# Altium schematic sheet sd_accel.SchDoc
size A
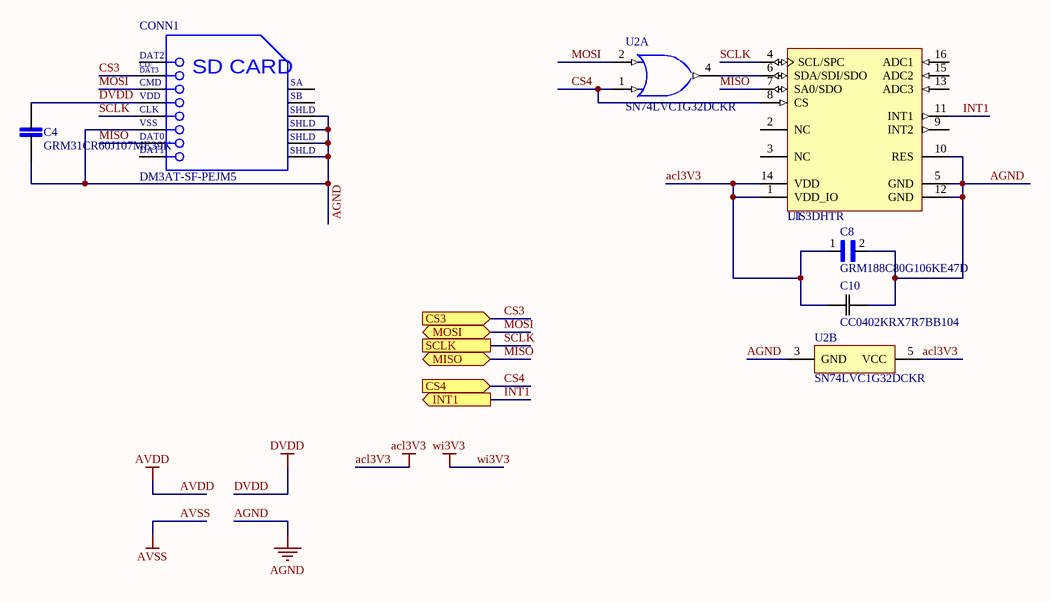
[diagram p0: sd_accel.SchDoc]

## Parts
C4  GRM31CR60J107ME39K  [*CAPC3216X190]
C8  GRM188C80G106KE47D  [*CAPC1608X90N]
C10  CC0402KRX7R7BB104  [YAG_CC0402]
CONN1  DM3AT-SF-PEJM5  [HRS-DM3AT-8_V]
U1  LIS3DHTR  [STM-LGA-16]
U2  SN74LVC1G32DCKR  [DCK0005A_N]  (parts A,B of 2)

## Ports
CS3 (in), CS4 (in), INT1 (out), MISO (bidir), MOSI (bidir), SCLK

## Nets
acl3V3: C8.1 C10.1 U1.1(VDD_IO) U1.14(VDD) U2.5(VCC)
AGND: C4.2 C8.2 C10.2 CONN1.6(VSS) CONN1.11(SHLD) CONN1.12(SHLD) CONN1.13(SHLD) CONN1.14(SHLD) U1.5(GND) U1.10(RES) U1.12(GND) U2.3(GND)
DVDD: C4.1 CONN1.4(VDD)
CS3: CONN1.2(CD/DAT3) ; port CS3
CS4: U1.8(CS) U2.1(A) ; port CS4
INT1: U1.11(INT1) ; port INT1
MISO: CONN1.7(DAT0) U1.7(SA0/SDO) ; port MISO
MOSI: CONN1.3(CMD) U2.2(B) ; port MOSI
SCLK: CONN1.5(CLK) U1.4(SCL/SPC) ; port SCLK
NetU1_6: U1.6(SDA/SDI/SDO) U2.4(Y)

Not connected (* = marked no-connect by the designer): CONN1 1(DAT2) 8(DAT1) 9(SA) 10(SB); U1 2(NC) 3(NC) 9(INT2) 13(ADC3) 15(ADC2) 16(ADC1)

## Notes on the sheet
- (in symbol DM3AT-SF-PEJM5) CD/; DAT3; SD CARD

## Library data of the parts
C4 = GRM31CR60J107ME39K: MURATA - GRM31CR60J107ME39K - COND, 100µF, 6.3V, 20%, X5R, 1206; Capacitance: 100uF; Supplier 1: Digi-Key; Manufacturer 1: Murata; Manufacturer Part Number 1: GRM31CR60J107ME39K; Stock 1: 407390; Pricing 1: 1=0.98000, 10=0.77400, 100=0.58060, 500=0.43870, 1000=0.38709, 2500=0.36128 (USD); RoHS: Yes; Mount: Surface Mount; Case/Package: 1206; Case Code (Imperial): 1206; Case Code (Metric): 3216; Min Operating Temperature: -55°C; Max Operating Temperature: 85°C; Tolerance: 20%; Packaging: Tape and Reel; Package Quantity: 1; Voltage Rating: 6.3V; Dielectric: X5R; Termination: SMD/SMT; Voltage: 6.3V; Voltage Rating (DC): 6.3V; Length: 3.2mm; Height: 1.6mm; Width: 0.063inch; Thickness: 0.071inch; Depth: 1.6mm; Radiation Hardening: No; REACH SVHC: No SVHC; Lead Free: Lead Free; ComponentLink1URL: https://datasheet.ciiva.com/13246/product-13246228.pdf?src-supplier=Mouser; ComponentLink1Description: https://datasheet.ciiva.com/13246/product-13246228.pdf?src-supplier=Mouser; ComponentLink2URL: https://datasheet.ciiva.com/18697/grm31cr60j107me39-01-18697367.pdf?src-supplier=Digi-Key; ComponentLink2Description: https://datasheet.ciiva.com/18697/grm31cr60j107me39-01-18697367.pdf?src-supplier=Digi-Key; ComponentLink3URL: https://datasheet.ciiva.com/18697/grm31cr60j107me39-01-18697368.pdf?src-supplier=Digi-Key; ComponentLink3Description: https://datasheet.ciiva.com/18697/grm31cr60j107me39-01-18697368.pdf?src-supplier=Digi-Key; ComponentLink4URL: https://datasheet.ciiva.com/18697/grm31cr60j107me39-01-18697369.pdf?src-supplier=Digi-Key; ComponentLink4Description: https://datasheet.ciiva.com/18697/grm31cr60j107me39-01-18697369.pdf?src-supplier=Digi-Key; Supplier Part Number 1: 490-7217-1-ND
C8 = GRM188C80G106KE47D: CAP CER 10UF 4V X6S 0603; Manufacturer 1: Murata; Tolerance: 10%; Supplier 1: Digi-Key; Manufacturer Part Number 1: GRM188C80G106KE47D; Stock 1: 203819; Pricing 1: 1=0.17000, 10=0.11800, 100=0.05990, 500=0.04098, 1000=0.03625 (USD); RoHS: Yes; Mount: Surface Mount; Case/Package: 0603; Weight: 0.000222oz; Case Code (Metric): 1608; Case Code (Imperial): 0603; Min Operating Temperature: -55°C; Max Operating Temperature: 105°C; Capacitance: 10uF; Packaging: Tape and Reel; Voltage Rating: 4V; Dielectric: X6S; Termination: SMD/SMT; Voltage Rating (DC): 4V; Package Quantity: 4000; Length: 0.063inch; Height: 0.8mm; Width: 0.031inch; Thickness: 0.035inch; ComponentLink1URL: http://www.mouser.com/ds/2/281/c02e-2905.pdf?src-supplier=Mouser; ComponentLink1Description: http://www.mouser.com/ds/2/281/c02e-2905.pdf?src-supplier=Mouser; ComponentLink2URL: http://search.murata.co.jp/Ceramy/image/img/A01X/G101/ENG/GRM188C80G106KE47-01.pdf?src-supplier=Digi-Key; ComponentLink2Description: http://search.murata.co.jp/Ceramy/image/img/A01X/G101/ENG/GRM188C80G106KE47-01.pdf?src-supplier=Digi-Key; Supplier Part Number 1: 490-10469-1-ND
C10 = CC0402KRX7R7BB104: CAP CER 0.1UF 16V X7R 0402; Manufacturer 1: Yageo; Capacitance: 100nF; Tolerance: 10%; Supplier 1: Digi-Key; Manufacturer Part Number 1: CC0402KRX7R7BB104; Stock 1: 30032352; Pricing 1: 1=0.10000, 10=0.03200, 100=0.01420, 500=0.01014, 1000=0.00797, 2500=0.00724, 5000=0.00667 (USD); RoHS: Yes; Mount: Surface Mount; Case/Package: 0402; Number of Pins: 2; Case Code (Metric): 1005; Case Code (Imperial): 0402; Min Operating Temperature: -55°C; Max Operating Temperature: 125°C; Voltage Rating: 16V; Voltage Rating (DC): 16V; Packaging: Tape and Reel; Package Quantity: 1; Dielectric: X7R; Termination: SMD/SMT; Composition: Ceramic; Voltage: 16V; Length: 1mm; Height: 0.5mm; Width: 0.02inch; Thickness: 0.022inch; Depth: 0.5mm; Radiation Hardening: No; REACH SVHC: No SVHC; Lead Free: Lead Free; Halogen Free: Halogen Free; ComponentLink1URL: https://datasheet.ciiva.com/11788/0900766b80ce67ed-11788364.pdf?src-supplier=RSComponents; ComponentLink1Description: https://datasheet.ciiva.com/11788/0900766b80ce67ed-11788364.pdf?src-supplier=RSComponents; ComponentLink2URL: https://datasheet.ciiva.com/16625/upy-gphc-x7r-6-3v-to-50v-8-16625511.pdf?src-supplier=Avnet+Europe; ComponentLink2Description: https://datasheet.ciiva.com/16625/upy-gphc-x7r-6-3v-to-50v-8-16625511.pdf?src-supplier=Avnet+Europe; ComponentLink3URL: https://datasheet.ciiva.com/161/mlccorderingcode-161544.pdf?src-supplier=Digi-Key; ComponentLink3Description: https://datasheet.ciiva.com/161/mlccorderingcode-161544.pdf?src-supplier=Digi-Key; ComponentLink4URL: https://datasheet.ciiva.com/161/mlccorderingcode-161545.pdf?src-supplier=Digi-Key; ComponentLink4Description: https://datasheet.ciiva.com/161/mlccorderingcode-161545.pdf?src-supplier=Digi-Key; ComponentLink5URL: https://datasheet.ciiva.com/8033/1734573-8033661.pdf?src-supplier=Element14; ComponentLink5Description: https://datasheet.ciiva.com/8033/1734573-8033661.pdf?src-supplier=Element14; ComponentLink6URL: https://datasheet.ciiva.com/7978/1489800-7978111.pdf?src-supplier=Element14; ComponentLink6Description: https://datasheet.ciiva.com/7978/1489800-7978111.pdf?src-supplier=Element14; ComponentLink7URL: https://datasheet.ciiva.com/8033/1734573-8033663.pdf?src-supplier=Element14; ComponentLink7Description: https://datasheet.ciiva.com/8033/1734573-8033663.pdf?src-supplier=Element14; ComponentLink8URL: https://datasheet.ciiva.com/11587/upy-gphc-x7r-6-3v-to-50v-8-11587305.pdf?src-supplier=Avnet; ComponentLink8Description: https://datasheet.ciiva.com/11587/upy-gphc-x7r-6-3v-to-50v-8-11587305.pdf?src-supplier=Avnet; ComponentLink9URL: https://datasheet.ciiva.com/161/mlccorderingcode-161546.pdf?src-supplier=Digi-Key; ComponentLink9Description: https://datasheet.ciiva.com/161/mlccorderingcode-161546.pdf?src-supplier=Digi-Key; ComponentLink10URL: https://datasheet.ciiva.com/13395/upy-gphc-x7r-6-3v-to-50v-8-13395676.pdf?src-supplier=Mouser; ComponentLink10Description: https://datasheet.ciiva.com/13395/upy-gphc-x7r-6-3v-to-50v-8-13395676.pdf?src-supplier=Mouser; ComponentLink11URL: https://datasheet.ciiva.com/28450/1489800-28450335.pdf?src-supplier=Element14; ComponentLink11Description: https://datasheet.ciiva.com/28450/1489800-28450335.pdf?src-supplier=Element14; Supplier Part Number 1: 311-1338-1-ND
CONN1 = DM3AT-SF-PEJM5: CONN MICRO SD CARD PUSH-PUSH R/A; Manufacturer 1: Hirose; Max Current Rating: 500mA; Voltage Rating: 125V; Connector Type: Connector; Number of Contacts: 8; Gender: Female; Pitch: 1.1mm; Supplier 1: Digi-Key; Manufacturer Part Number 1: DM3AT-SF-PEJM5; Stock 1: 21659; Pricing 1: 1=2.67000, 10=2.56100, 25=2.34760, 50=2.24080, 100=2.13400, 250=1.86724, 500=1.81390 (USD); RoHS: Yes; Mount: Surface Mount,Standard; Contact Material: Copper Alloy; Contact Plating: Gold; Housing Material: Polymer; Min Operating Temperature: -25°C; Max Operating Temperature: 85°C; Number of Rows: 1; Packaging: Tape and Reel; Package Quantity: 1; Current Rating: 500mA; Termination: SMD/SMT; Max Voltage Rating (AC): 125V; Number of Positions: 8; Orientation: Right Angle; Length: 15.95mm; Height: 1.68mm; Width: 13.85mm; Depth: 15.95mm; Radiation Hardening: No; REACH SVHC: No SVHC; Lead Free: Lead Free; Flammability Rating: UL94 V-0; ComponentLink1URL: https://datasheet.ciiva.com/683/e60900232-683393.pdf?src-supplier=Digi-Key; ComponentLink1Description: https://datasheet.ciiva.com/683/e60900232-683393.pdf?src-supplier=Digi-Key; ComponentLink2URL: https://datasheet.ciiva.com/683/e60900232-683394.pdf?src-supplier=Digi-Key; ComponentLink2Description: https://datasheet.ciiva.com/683/e60900232-683394.pdf?src-supplier=Digi-Key; ComponentLink3URL: https://datasheet.ciiva.com/683/e60900232-683395.pdf?src-supplier=Digi-Key; ComponentLink3Description: https://datasheet.ciiva.com/683/e60900232-683395.pdf?src-supplier=Digi-Key; ComponentLink4URL: https://datasheet.ciiva.com/46418/1697167-46418261.pdf?src-supplier=Element14; ComponentLink4Description: https://datasheet.ciiva.com/46418/1697167-46418261.pdf?src-supplier=Element14; ComponentLink5URL: https://datasheet.ciiva.com/3122/e60900232-3122534.pdf?src-supplier=Avnet; ComponentLink5Description: https://datasheet.ciiva.com/3122/e60900232-3122534.pdf?src-supplier=Avnet; ComponentLink6URL: https://datasheet.ciiva.com/46418/1697167-46418262.pdf?src-supplier=Element14; ComponentLink6Description: https://datasheet.ciiva.com/46418/1697167-46418262.pdf?src-supplier=Element14; ComponentLink7URL: https://datasheet.ciiva.com/16205/e60900232-16205727.pdf?src-supplier=Future+Electronics; ComponentLink7Description: https://datasheet.ciiva.com/16205/e60900232-16205727.pdf?src-supplier=Future+Electronics; Supplier Part Number 1: HR1964CT-ND
U1 = LIS3DHTR: ACCEL 2-16G I2C/SPI 16LGA; Manufacturer 1: STMicroelectronics; Interface: I2C,SPI; Sensor Type: 3 Axis; Max Supply Voltage: 3.6V; Min Supply Voltage: 1.71V; Operating Supply Voltage: 2.5V; Bandwidth: 5kHz; Resolution: 16b; Operating Supply Current: 11uA; Output Type: Digital; Axis: X, Y, Z; Supplier 1: Digi-Key; Manufacturer Part Number 1: LIS3DHTR; Stock 1: 56055; Pricing 1: 1=1.63000, 10=1.46000, 100=1.13850, 500=0.94050, 1000=0.74250 (USD); RoHS: Yes; Case/Package: LGA; Number of Pins: 16; Contact Plating: Gold; Min Operating Temperature: -40°C; Max Operating Temperature: 85°C; Package Quantity: 1; Packaging: Tape and Reel; Max Supply Voltage (DC): 3.6V; Min Supply Voltage (DC): 1.71V; Length: 3mm; Height: 1mm; Depth: 3mm; Width: 3mm; Radiation Hardening: No; REACH SVHC: No SVHC; Lead Free: Lead Free; ComponentLink1URL: https://datasheet.ciiva.com/7621/1718591-7621744.pdf?src-supplier=Element14; ComponentLink1Description: https://datasheet.ciiva.com/7621/1718591-7621744.pdf?src-supplier=Element14; ComponentLink2URL: https://datasheet.ciiva.com/16638/cd00274221-16638192.pdf?src-supplier=Avnet+Europe; ComponentLink2Description: https://datasheet.ciiva.com/16638/cd00274221-16638192.pdf?src-supplier=Avnet+Europe; ComponentLink3URL: https://datasheet.ciiva.com/5296/cd00274221-117431-5296513.pdf?src-supplier=Mouser; ComponentLink3Description: https://datasheet.ciiva.com/5296/cd00274221-117431-5296513.pdf?src-supplier=Mouser; ComponentLink4URL: https://datasheet.ciiva.com/26928/lis3dhtr-26928589.pdf?src-supplier=IIIC; ComponentLink4Description: https://datasheet.ciiva.com/26928/lis3dhtr-26928589.pdf?src-supplier=IIIC; ComponentLink5URL: https://datasheet.ciiva.com/2810/cd00274221-2810008.pdf?src-supplier=Digi-Key; ComponentLink5Description: https://datasheet.ciiva.com/2810/cd00274221-2810008.pdf?src-supplier=Digi-Key; ComponentLink6URL: https://datasheet.ciiva.com/2810/cd00274221-2810009.pdf?src-supplier=Digi-Key; ComponentLink6Description: https://datasheet.ciiva.com/2810/cd00274221-2810009.pdf?src-supplier=Digi-Key; ComponentLink7URL: https://datasheet.ciiva.com/48495/cd00274221-48495849.pdf?src-supplier=Avnet; ComponentLink7Description: https://datasheet.ciiva.com/48495/cd00274221-48495849.pdf?src-supplier=Avnet; ComponentLink8URL: https://datasheet.ciiva.com/2810/cd00274221-2810010.pdf?src-supplier=Digi-Key; ComponentLink8Description: https://datasheet.ciiva.com/2810/cd00274221-2810010.pdf?src-supplier=Digi-Key; ComponentLink9URL: https://datasheet.ciiva.com/16216/cd00274221-16216362.pdf?src-supplier=Future+Electronics; ComponentLink9Description: https://datasheet.ciiva.com/16216/cd00274221-16216362.pdf?src-supplier=Future+Electronics; ComponentLink10URL: https://datasheet.ciiva.com/16470/cd00274221-16470411.pdf?src-supplier=Avnet+Asia; ComponentLink10Description: https://datasheet.ciiva.com/16470/cd00274221-16470411.pdf?src-supplier=Avnet+Asia; ComponentLink11URL: https://datasheet.ciiva.com/3271/cd00274221-3271807.pdf?src-supplier=Avnet; ComponentLink11Description: https://datasheet.ciiva.com/3271/cd00274221-3271807.pdf?src-supplier=Avnet; Supplier Part Number 1: 497-10613-1-ND
U2 = SN74LVC1G32DCKR: IC GATE OR 1CH 2-INP SC70-5; Manufacturer 1: Texas Instruments; Output Current: 32mA; Number of Inputs: 2; Min Supply Voltage: 1.65V; Max Supply Voltage: 5.5V; Propagation Delay: 4ns; Number of Elements: 1; Quiescent Current: 10uA; High Level Output Current: -32mA; Turn-On Delay Time: 4.5ns; Schmitt Trigger Input: No; Supplier 1: Digi-Key; Manufacturer Part Number 1: SN74LVC1G32DCKR; Stock 1: 153903; Pricing 1: 1=0.33000, 10=0.24700, 100=0.14000, 500=0.09270, 1000=0.07107 (USD); RoHS: Yes; Mount: Surface Mount; Case/Package: SC; Number of Pins: 5; Weight: 8.8E-05oz; Contact Plating: Gold; Min Operating Temperature: -40°C; Max Operating Temperature: 125°C; Max Output Current: 32mA; Package Quantity: 1; Packaging: Tape and Reel; Logic Function: OR; Number of Outputs: 1; Number of Circuits: 1; Low Level Output Current: 32mA; Number of Gates: 1; Number of Input Lines: 2; Number of Output Lines: 1; Termination: SMD/SMT; Number of Bits: 1; Length: 2mm; Height: 0.9mm; Width: 1.25mm; Radiation Hardening: No; REACH SVHC: No SVHC; Lead Free: Lead Free; ComponentLink1URL: https://datasheet.ciiva.com/1864/sn74lvc1g32-1864192.pdf?src-supplier=Digi-Key; ComponentLink1Description: https://datasheet.ciiva.com/1864/sn74lvc1g32-1864192.pdf?src-supplier=Digi-Key; ComponentLink2URL: https://datasheet.ciiva.com/6124/1768050-6124560.pdf?src-supplier=Farnell; ComponentLink2Description: https://datasheet.ciiva.com/6124/1768050-6124560.pdf?src-supplier=Farnell; ComponentLink3URL: https://datasheet.ciiva.com/15090/getdatasheetpartid-127914-15090759.pdf?src-supplier=Verical; ComponentLink3Description: https://datasheet.ciiva.com/15090/getdatasheetpartid-127914-15090759.pdf?src-supplier=Verical; ComponentLink4URL: https://datasheet.ciiva.com/27049/756781-27049784.pdf?src-supplier=Jameco; ComponentLink4Description: https://datasheet.ciiva.com/27049/756781-27049784.pdf?src-supplier=Jameco; ComponentLink5URL: https://datasheet.ciiva.com/7783/1768050-7783469.pdf?src-supplier=Element14; ComponentLink5Description: https://datasheet.ciiva.com/7783/1768050-7783469.pdf?src-supplier=Element14; ComponentLink6URL: https://datasheet.ciiva.com/14290/sn74lvc1g32-14290781.pdf?src-supplier=Avnet; ComponentLink6Description: https://datasheet.ciiva.com/14290/sn74lvc1g32-14290781.pdf?src-supplier=Avnet; ComponentLink7URL: https://datasheet.ciiva.com/7783/1768050-7783470.pdf?src-supplier=Element14; ComponentLink7Description: https://datasheet.ciiva.com/7783/1768050-7783470.pdf?src-supplier=Element14; ComponentLink8URL: https://datasheet.ciiva.com/26048/sn74lvc1g32-26048814.pdf?src-supplier=Avnet+Europe; ComponentLink8Description: https://datasheet.ciiva.com/26048/sn74lvc1g32-26048814.pdf?src-supplier=Avnet+Europe; ComponentLink9URL: https://datasheet.ciiva.com/1864/sn74lvc1g32-1864193.pdf?src-supplier=Digi-Key; ComponentLink9Description: https://datasheet.ciiva.com/1864/sn74lvc1g32-1864193.pdf?src-supplier=Digi-Key; ComponentLink10URL: https://datasheet.ciiva.com/16503/sn74lvc1g32-16503418.pdf?src-supplier=Avnet+Asia; ComponentLink10Description: https://datasheet.ciiva.com/16503/sn74lvc1g32-16503418.pdf?src-supplier=Avnet+Asia; ComponentLink11URL: https://datasheet.ciiva.com/1864/sn74lvc1g32-1864191.pdf?src-supplier=Digi-Key; ComponentLink11Description: https://datasheet.ciiva.com/1864/sn74lvc1g32-1864191.pdf?src-supplier=Digi-Key; Supplier Part Number 1: 296-9848-1-ND